# EAGLE schematic orbit-board (EAGLE 6.3)
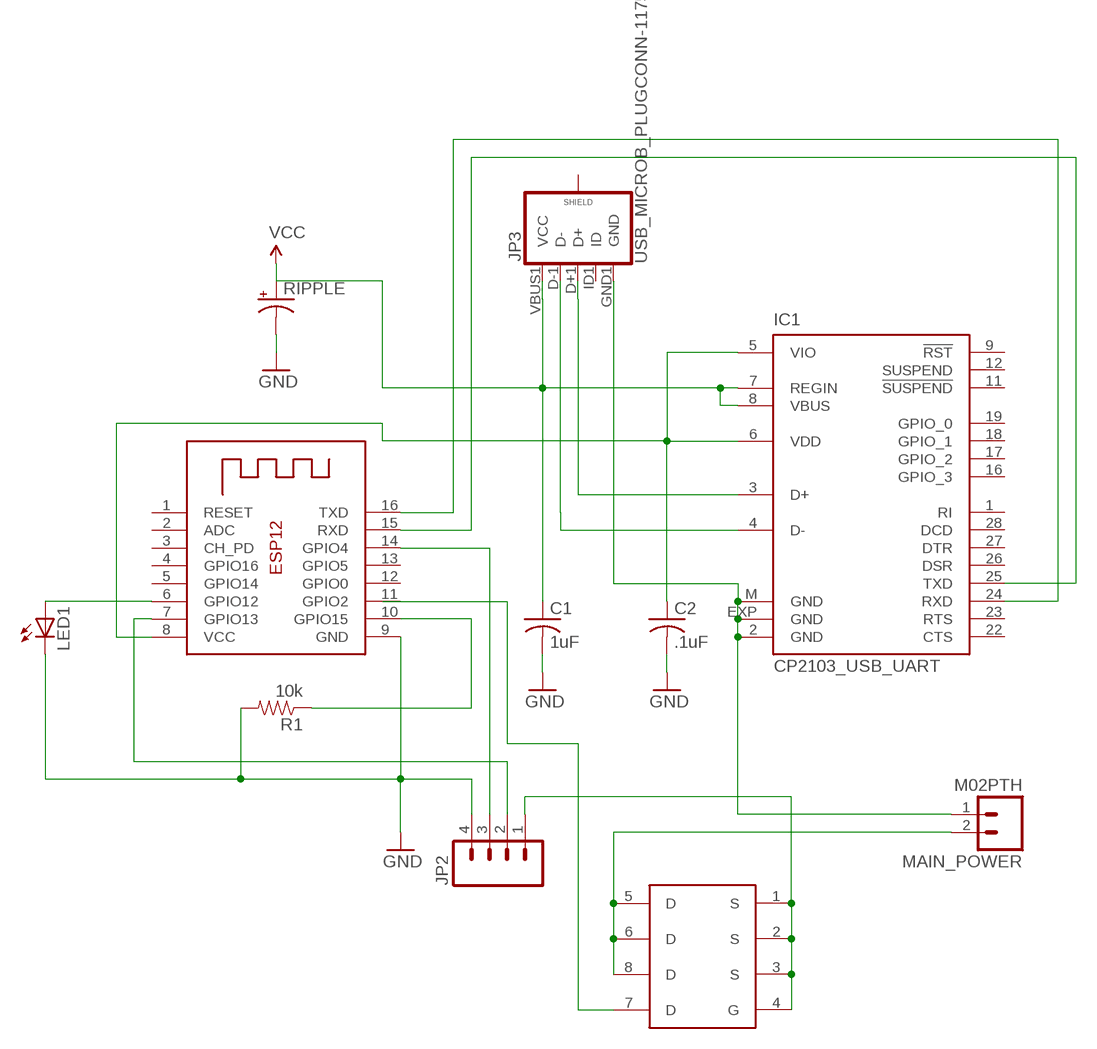
[diagram p0: schematic, sheet 1]

## Parts
C1  1uF  C-USC0603  [C0603]
C2  .1uF  C-USC0603  [C0603]
IC1  CP2103_USB_UART  [MLP28]
JP2  M04PTH  [1X04]
JP3  USB_MICROB_PLUGCONN-11752  [USB-B-MICRO-SMD_V03]
LED1  LEDSML1206  [SML1206]
MAIN_POWER  M02PTH  [1X02]
R1  10k  RESISTOR0603-RES  [0603-RES]
RIPPLE  CAP_POLPTH2  [CPOL-RADIAL-10UF-25V]
U$1  NDS8434  [SO08]
X1  ESP-12  [ESP-12]

## Nets
GND: C1.2 C2.2 JP2.4 LED1.C R1.2 RIPPLE.2(-) X1.9(GND)
N$1: IC1.2(GND) IC1.EXP(GND) IC1.M(GND) JP3.GND1(GND) MAIN_POWER.1
N$2: IC1.3(D+) JP3.D+1(D+)
N$3: IC1.4(D-) JP3.D-1(D-)
N$4: C2.1 IC1.5(VIO) IC1.6(VDD) X1.8(VCC)
N$5: LED1.A X1.6(GPIO12)
N$6: JP2.3 X1.14(GPIO4)
N$7: JP2.2 X1.7(GPIO13)
N$8: IC1.24(RXD) X1.16(TXD)
N$9: IC1.25(TXD) X1.15(RXD)
N$10: R1.1 X1.10(GPIO15)
N$11: MAIN_POWER.2 U$1.5(D) U$1.6(D) U$1.8(D)
N$12: U$1.7(D)
N$14: JP2.1 U$1.1(S) U$1.2(S) U$1.3(S) U$1.4(G)
VCC: C1.1 IC1.7(REGIN) IC1.8(VBUS) JP3.VBUS1(VCC) RIPPLE.1(+)
Unconnected: IC1.1(RI) IC1.9(!RST) IC1.11(!SUSPEND) IC1.12(SUSPEND) IC1.16(GPIO_3) IC1.17(GPIO_2) IC1.18(GPIO_1) IC1.19(GPIO_0) IC1.22(CTS) IC1.23(RTS) IC1.26(DSR) IC1.27(DTR) IC1.28(DCD) JP3.ID1(ID) JP3.SHIELD1(SHIELD) JP3.SHIELD2(SHIELD) JP3.SHIELD3(SHIELD) X1.1(RESET) X1.2(ADC) X1.3(CH_PD) X1.4(GPIO16) X1.5(GPIO14) X1.11(GPIO2) X1.12(GPIO0) X1.13(GPIO5)

## Library data of the parts
C1 C2 = adafruit:C-US: CAPACITOR, American symbol
IC1 = SparkFun-DigitalIC:CP2103_USB_UART: Single-Chip USB to UART Bridge Source: www.silabs.com .. CP2103.pdf. Spark Fun Electronics SKU : COM-00309
JP2 = SparkFun-Connectors:M04: Header 4 Standard 4-pin 0.1" header. Use with straight break away headers (SKU : PRT-00116), right angle break away headers (PRT-00553), swiss pins (PRT-00743), machine pins (PRT-00117), and female headers (PRT-00115). Molex polarized connector foot print use with SKU : PRT-08231 with associated crimp pins and housings. 1MM SMD Version SKU: PRT-10208
JP3 = SparkFun-Connectors:USB_MICROB_PLUG: USB Micro-B connectors Some male, some female. Watch your step!; PROD_ID: CONN-11752
LED1 = led:LED: LED OSRAM: - CHIPLED LG R971, LG N971, LY N971, LG Q971, LY Q971, LO R971, LY R971 LH N974, LH R974 LS Q976, LO Q976, LY Q976 LO Q996 - Hyper CHIPLED LW Q18S LB Q993, LB Q99A, LB R99A - SideLED LS A670, LO A670, LY A670, LG A670, LP A670 LB A673, LV A673, LT A673, LW A673 LH A674 LY A675 LS A676, LA A676, LO A676, LY A676, LW A676 LS A679, LY A679, LG A679 - Hyper Micro SIDELED® LS Y876, LA Y876, LO Y876, LY Y876 LT Y87S - SmartLED LW L88C, LW L88S LB L89C, LB L89S, LG L890 LS L89K, LO L89K, LY L89K LS L896, LA L896, LO L896, LY L896 - TOPLED LS T670, LO T670, LY T670, LG T670, LP T670 LSG T670, LSP T670, LSY T670, LOP T670, LYG T670 LG T671, LOG T671, LSG T671 LB T673, LV T673, LT T673, LW T673 LH T674 LS T676, LA T676, LO T676, LY T676, LB T676, LH T676, LSB T676, LW T676 LB T67C, LV T67C, LT T67C, LS T67K, LO T67K, LY T67K, LW E67C LS E67B, LA E67B, LO E67B, LY E67B, LB E67C, LV E67C, LT E67C LW T67C LS T679, LY T679, LG T679 LS T770, LO T770, LY T770, LG T770, LP T770 LB T773, LV T773, LT T773, LW T773 LH T774 LS E675, LA E675, LY E675, LS T675 LS T776, LA T776, LO T776, LY T776, LB T776 LHGB T686 LT T68C, LB T68C - Hyper Mini TOPLED® LB M676 - Mini TOPLED Santana® LG M470 LS M47K, LO M47K, LY M47K Source: http://www.osram.convergy.de LUXEON: - LUMILED® LXK2-PW12-R00, LXK2-PW12-S00, LXK2-PW14-U00, LXK2-PW14-V00 LXK2-PM12-R00, LXK2-PM12-S00, LXK2-PM14-U00 LXK2-PE12-Q00, LXK2-PE12-R00, LXK2-PE12-S00, LXK2-PE14-T00, LXK2-PE14-U00 LXK2-PB12-K00, LXK2-PB12-L00, LXK2-PB12-M00, LXK2-PB14-N00, LXK2-PB14-P00, LXK2-PB14-Q00 LXK2-PR12-L00, LXK2-PR12-M00, LXK2-PR14-Q00, LXK2-PR14-R00 LXK2-PD12-Q00, LXK2-PD12-R00, LXK2-PD12-S00 LXK2-PH12-R00, LXK2-PH12-S00 LXK2-PL12-P00, LXK2-PL12-Q00, LXK2-PL12-R00 Source: www.luxeon.com KINGBRIGHT: KA-3528ASYC Source: www.kingbright.com
MAIN_POWER = SparkFun-Connectors:M02: Standard 2-pin 0.1" header. Use with - straight break away headers ( PRT-00116) - right angle break away headers (PRT-00553) - swiss pins (PRT-00743) - machine pins (PRT-00117) - female headers (PRT-00115) Molex polarized connector foot print use with: PRT-08233 with associated crimp pins and housings. 2.54_SCREWTERM for use with PRT-10571. 3.5mm Screw Terminal footprints for PRT-08084 5mm Screw Terminal footprints for use with PRT-08432
R1 = SparkFun-Passives:RESISTOR: Resistor Basic schematic elements and footprints for 0603, 1206, and PTH resistors.
RIPPLE = SparkFun-Capacitors:CAP_POL: Capacitor Polarized These are standard SMD and PTH capacitors. Normally 10uF, 47uF, and 100uF in electrolytic and tantalum varieties. Always verify the external diameter of the through hole cap, it varies with capacity, voltage, and manufacturer. The EIA devices should be standard.
U$1 = SparkFun-DiscreteSemi:NDS8434: 8-SOIC NMOSFET
X1 = adafruit:ESP-12